# Altium project stm32F405RGT6 minisystem.PrjPCB
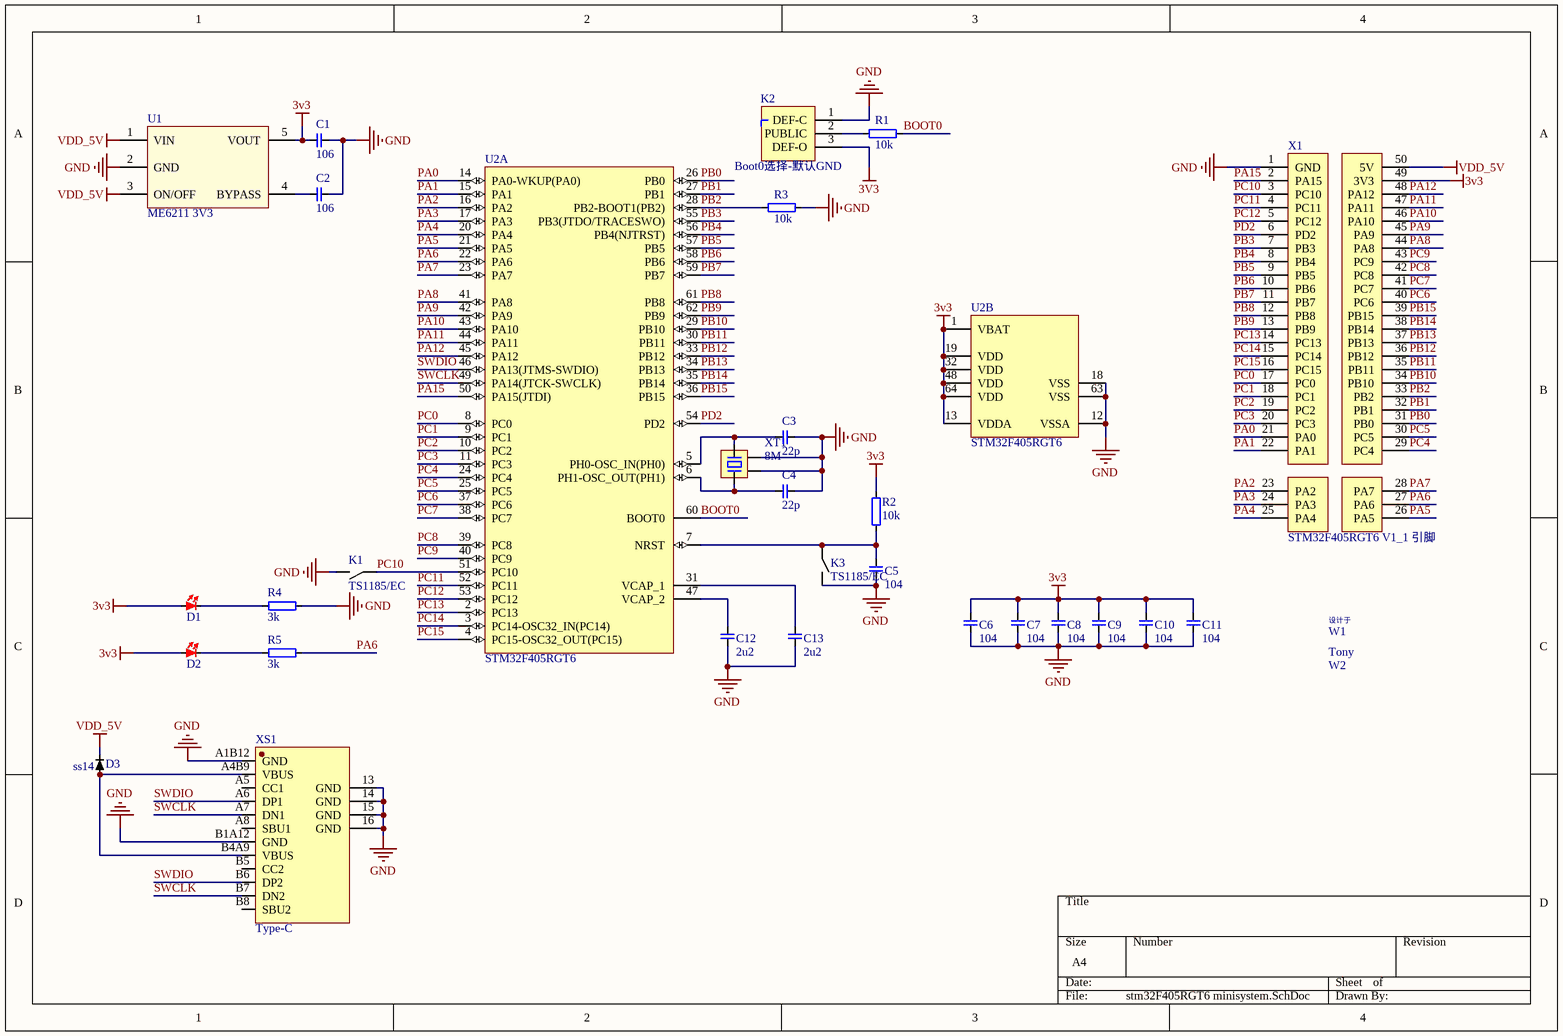
[diagram p0: stm32F405RGT6 minisystem.SchDoc]
1 sheet, 31 parts. Net scope: global (net labels, ports and power ports of the same name join across sheets).
Board file: stm32F405RGT6 minisystem.PcbDoc

## Sheet stm32F405RGT6 minisystem.SchDoc
size A4

### Parts
C1  106  [CAP_0603]
C2  106  [CAP_0603]
C3  22p  [CAP_0603]
C4  22p  [CAP_0603]
C5  104  [CAP_0603]
C6  104  [CAP_0603]
C7  104  [CAP_0603]
C8  104  [CAP_0603]
C9  104  [CAP_0603]
C10  104  [CAP_0603]
C11  104  [CAP_0603]
C12  2u2  [CAP_0603]
C13  2u2  [CAP_0603]
D1  led  [led0603]  (value not drawn)
D2  led  [led0603]  (value not drawn)
D3  ss14  [SOD-323]
K1  TS1185/EC  [TS-1185EC-X-X-X]
K2  Boot0选择-默认GND  [Switch 1-2 0603]
K3  TS1185/EC  [TS-1185EC-X-X-X]
R1  10k  [RES_0603]
R2  10k  [RES_0603]
R3  10k  [RES_0603]
R4  3k  [RES_0603]
R5  3k  [RES_0603]
U1  ME6211 3V3  [SOT23-5]
U2  STM32F405RGT6  [LQFP64]  (parts A,B of 2)
W1  设计于  [designed by（430-70）]  (value not drawn)
W2  Tony  [Tony_2(200-70)]  (value not drawn)
X1  STM32F405RGT6 V1_1 引脚  [STM32F405RGT6 V1_1引脚]
XS1  Type-C  [TypeC-304-16BCP]
XT1  8M  [SMD3225_4p]

### Nets
3v3: C1.2 C6.1 C7.1 C8.1 C9.1 C10.1 C11.1 D1.1 D2.1 K2.3(DEF-O) R2.2 U1.5(VOUT) U2.1(VBAT) U2.13(VDDA) U2.19(VDD) U2.32(VDD) U2.48(VDD) U2.64(VDD) X1.49(3V3)
GND: C1.1 C2.1 C3.1 C4.1 C5.2 C6.2 C7.2 C8.2 C9.2 C10.2 C11.2 C12.2 C13.2 K1.2 K2.1(DEF-C) K3.2 R3.2 R4.1 U1.2(GND) U2.12(VSSA) U2.18(VSS) U2.63(VSS) X1.1(GND) XS1.13(GND) XS1.14(GND) XS1.15(GND) XS1.16(GND) XS1.A1B12(GND) XS1.B1A12(GND) XT1.2(GND) XT1.4(GND)
VDD_5V: D3.2 U1.1(VIN) U1.3(ON/OFF) X1.50(5V)
BOOT0: R1.2 U2.60(BOOT0)
PA0: U2.14(PA0-WKUP(PA0)) X1.21(PA0)
PA1: U2.15(PA1) X1.22(PA1)
PA2: U2.16(PA2) X1.23(PA2)
PA3: U2.17(PA3) X1.24(PA3)
PA4: U2.20(PA4) X1.25(PA4)
PA5: U2.21(PA5) X1.26(PA5)
PA6: R5.1 U2.22(PA6) X1.27(PA6)
PA7: U2.23(PA7) X1.28(PA7)
PA8: U2.41(PA8) X1.44(PA8)
PA9: U2.42(PA9) X1.45(PA9)
PA10: U2.43(PA10) X1.46(PA10)
PA11: U2.44(PA11) X1.47(PA11)
PA12: U2.45(PA12) X1.48(PA12)
PA15: U2.50(PA15(JTDI)) X1.2(PA15)
PB0: U2.26(PB0) X1.31(PB0)
PB1: U2.27(PB1) X1.32(PB1)
PB2: R3.1 U2.28(PB2-BOOT1(PB2)) X1.33(PB2)
PB3: U2.55(PB3(JTDO/TRACESWO)) X1.7(PB3)
PB4: U2.56(PB4(NJTRST)) X1.8(PB4)
PB5: U2.57(PB5) X1.9(PB5)
PB6: U2.58(PB6) X1.10(PB6)
PB7: U2.59(PB7) X1.11(PB7)
PB8: U2.61(PB8) X1.12(PB8)
PB9: U2.62(PB9) X1.13(PB9)
PB10: U2.29(PB10) X1.34(PB10)
PB11: U2.30(PB11) X1.35(PB11)
PB12: U2.33(PB12) X1.36(PB12)
PB13: U2.34(PB13) X1.37(PB13)
PB14: U2.35(PB14) X1.38(PB14)
PB15: U2.36(PB15) X1.39(PB15)
PC0: U2.8(PC0) X1.17(PC0)
PC1: U2.9(PC1) X1.18(PC1)
PC2: U2.10(PC2) X1.19(PC2)
PC3: U2.11(PC3) X1.20(PC3)
PC4: U2.24(PC4) X1.29(PC4)
PC5: U2.25(PC5) X1.30(PC5)
PC6: U2.37(PC6) X1.40(PC6)
PC7: U2.38(PC7) X1.41(PC7)
PC8: U2.39(PC8) X1.42(PC8)
PC9: U2.40(PC9) X1.43(PC9)
PC10: K1.1 U2.51(PC10) X1.3(PC10)
PC11: U2.52(PC11) X1.4(PC11)
PC12: U2.53(PC12) X1.5(PC12)
PC13: U2.2(PC13) X1.14(PC13)
PC14: U2.3(PC14-OSC32_IN(PC14)) X1.15(PC14)
PC15: U2.4(PC15-OSC32_OUT(PC15)) X1.16(PC15)
PD2: U2.54(PD2) X1.6(PD2)
SWCLK: U2.49(PA14(JTCK-SWCLK)) XS1.A7(DN1) XS1.B7(DN2)
SWDIO: U2.46(PA13(JTMS-SWDIO)) XS1.A6(DP1) XS1.B6(DP2)
NetC2_2: C2.2 U1.4(BYPASS)
NetC3_2: C3.2 U2.5(PH0-OSC_IN(PH0)) XT1.3
NetC4_2: C4.2 U2.6(PH1-OSC_OUT(PH1)) XT1.1
NetC5_1: C5.1 K3.1 R2.1 U2.7(NRST)
NetC12_1: C12.1 U2.47(VCAP_2)
NetC13_1: C13.1 U2.31(VCAP_1)
NetD1_2: D1.2 R4.2
NetD2_2: D2.2 R5.2
NetD3_1: D3.1 XS1.A4B9(VBUS) XS1.B4A9(VBUS)
NetK2_2: K2.2(PUBLIC) R1.1

Not connected (* = marked no-connect by the designer): XS1 A5(CC1) A8(SBU1) B5(CC2) B8(SBU2)

### Library data of the parts
C1-C13 = cap
D3 = Diode
K1 K3 = Button-LT-3040: 3*4*2 立贴轻触开关 2Pin/4Pin
K2 = Switch 1-2: 单刀双掷1-2
R1-R5 = Res
U1 = ME6211: LDO
XS1 = Type-C母口
XT1 = XTAL-4P